# Altium project ESP32_KIT.PrjPcb
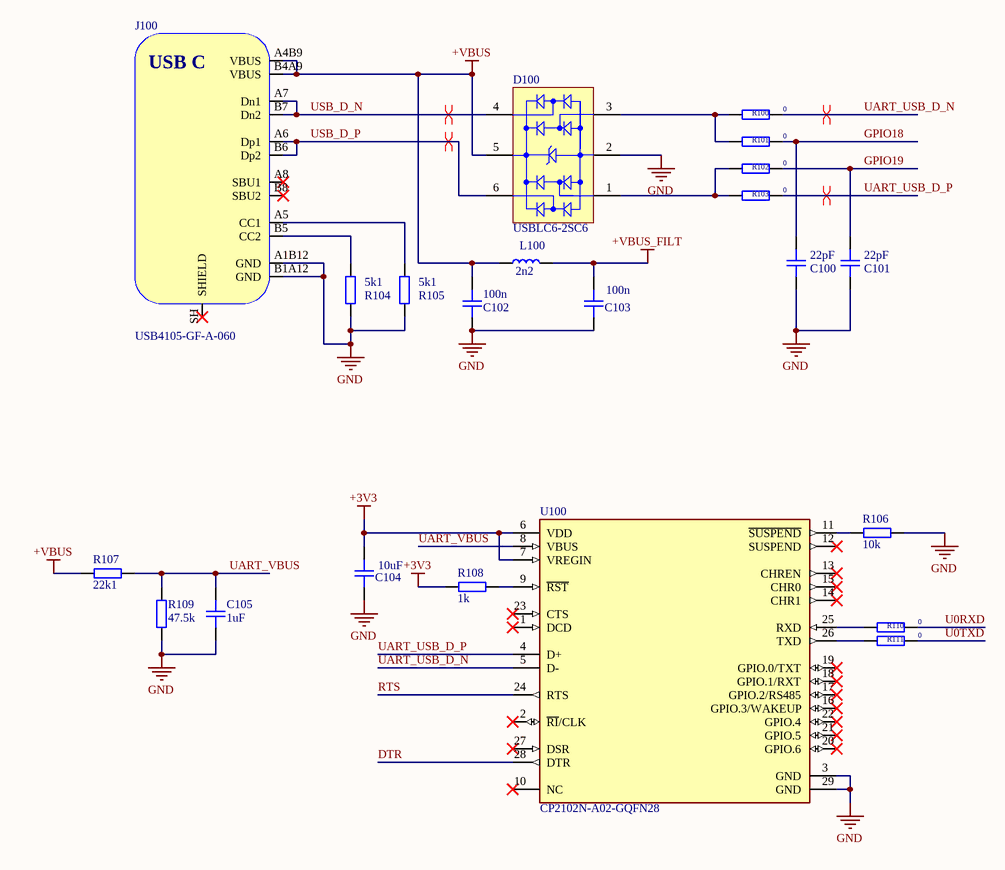
[diagram p0: 2_STM32KIT_UART.SchDoc]
4 sheets, 84 parts. Net scope: global (net labels, ports and power ports of the same name join across sheets).
Board file: ESP32_KIT.PcbDoc
Sheets:
  2_STM32KIT_UART.SchDoc
  3_STM32KIT_Power.SchDoc
  4_STM32KIT_MCU.SchDoc
  5_STM32KIT_Peripheral.SchDoc

## Sheet 2_STM32KIT_UART.SchDoc
size 381 x 241 mm; SheetNumber: 1; SheetTotal: 4

### Parts
C100  22pF  [CAP_0402]
C101  22pF  [CAP_0402]
C102  100n  [CAP_0603]
C103  100n  [CAP_0603]
C104  10uF  [CAP_0402]
C105  1uF  [CAP_0402]
D100  USBLC6-2SC6  [STM-SOT23-6L_V]
J100  USB4105-GF-A-060  [USB4105-GF-A-060]
L100  2n2  [IND_0603]
R100  0  [RES_0402]
R101  0  [RES_0402]
R102  0  [RES_0402]
R103  0  [RES_0402]
R104  5k1  [RES_0603]
R105  5k1  [RES_0603]
R106  10k  [RES_0402]
R107  22k1  [RES_0402]
R108  1k  [RES_0402]
R109  47.5k  [RES_0402]
R110  0  [RES_0402]
R111  0  [RES_0402]
U100  CP2102N-A02-GQFN28  [FP-CP2102N-A02-GQFN28-MFG]

### Nets
+3V3: C104.2 R108.1 U100.6(VDD) U100.7(VREGIN)
+VBUS: C102.2 D100.5(VBUS) J100.A4B9(VBUS) J100.B4A9(VBUS) L100.1 R107.2
+VBUS_FILT: C103.2 L100.2
GND: C100.1 C101.1 C102.1 C103.1 C104.1 C105.1 D100.2(GND) J100.A1B12(GND) J100.B1A12(GND) R104.1 R105.1 R106.2 R109.2 U100.3(GND) U100.29(GND)
DTR: U100.28(DTR)
GPIO18: C100.2 R101.2
GPIO19: C101.2 R102.2
RTS: U100.24(RTS)
U0RXD: R110.2
U0TXD: R111.2
UART_USB_D_N: R100.2 U100.5(D-)
UART_USB_D_P: R103.2 U100.4(D+)
UART_VBUS: C105.2 R107.1 R109.1 U100.8(VBUS)
USB_D_N: D100.4(I/O_3) J100.A7(Dn1) J100.B7(Dn2)
USB_D_P: D100.6(I/O_4) J100.A6(Dp1) J100.B6(Dp2)
NetD100_1: D100.1(I/O_1) R102.1 R103.1
NetD100_3: D100.3(I/O_2) R100.1 R101.1
NetJ100_A5: J100.A5(CC1) R105.2
NetJ100_B5: J100.B5(CC2) R104.2
NetR106_1: R106.1 U100.11(~{SUSPEND})
NetR108_2: R108.2 U100.9(~{RST})
NetR110_1: R110.1 U100.25(RXD)
NetR111_1: R111.1 U100.26(TXD)

Not connected (* = marked no-connect by the designer): J100 A8(SBU1)* B8(SBU2)* SH(SHIELD)*; U100 1(DCD)* 2(~{RI}/CLK)* 10(NC)* 12(SUSPEND)* 13(CHREN)* 14(CHR1)* 15(CHR0)* 16(GPIO.3/WAKEUP)* 17(GPIO.2/RS485)* 18(GPIO.1/RXT)* 19(GPIO.0/TXT)* 20(GPIO.6)* 21(GPIO.5)* 22(GPIO.4)* 23(CTS)* 27(DSR)*

### Layout directives
differential pair: UART_USB_D_N, UART_USB_D_P, USB_D_N, USB_D_P

### Notes on the sheet
- (in symbol CMP-002-00129-1) USB C

### Library data of the parts
C100 C101 C104 C105 = CMP-001-00086-1: Capacitor SMD 0402; Manufacturer: *; Distributor Link: *; Manufacturer Part Number: *; Design Item ID: CAP_0402; Dielectric: *; LCSC: *; Source: Schematic-Lib-PhilsLab.SchLib; Rating: *
C102 C103 = CMP-001-00087-1: Capacitor SMD 0603; Manufacturer Part Number: *; Distributor Link: *; Manufacturer: *; Rating: *; Design Item ID: CAP_0603; Source: Schematic-Lib-PhilsLab.SchLib; Dielectric: *; LCSC: *
D100 = CMP-2000-05378-1: Very low capacitance ESD protection, 3.5 pF, -40 to 125 degC, 6-Pin SOT23, RoHS, Tape and Reel; Manufacturer: STMicroelectronics; Polarity: Uni-Directional; Clamping Voltage: 17V; Rad Hardened: No; Product Height (mm): 1.3mm; Leakage Current (Max): 0.15uA; Product Length (mm): 3.05mm; Number of Elements: 1; Peak Pulse Current: 5A; Configuration: Dual; Reverse Breakdown Voltage: 6V; Working Voltage (Max): 5V; Capacitance Value: 3.5pF; Suppressor Type: DiodeArrays; Product Depth (mm): 1.75mm; Test Current (It): 1mA; Package / Case: SOT-23; Operating Temperature Max Deg. C: 125C; Package Description: 6-Pin Small Outline Transistor, Body 2.925 x 1.625 mm, Pitch 0.95 mm; Package Reference: SOT23-6L; Datasheet Version: Rev. 5, 10/2011; Operating Temperature Min Deg. C: -40C; Mounting Style: SurfaceMount; Direction Type: Uni-Directional; Mounting: SurfaceMount; Pin Count: 6; Leakage Current: 0.15uA; Packaging: TapeandReel; Operating Temperature Classification: Automotive; Clamping Voltage (Max): 17V; Manufacturer URL: http://www.st.com/; Reverse Stand-off Voltage: 5V; Datasheet URL: http://www.st.com/st-web-ui/static/active/en/resource/technical/document/datasheet/CD00050750.pdf; Working Voltage: 5V; Operating Temp Range: -40Cto125C; LCSC: C7519
J100 = CMP-002-00129-1: USB Connector Type C SMT 12 Pin; Manufacturer: GCT; Distributor Link: https://eu.mouser.com/ProductDetail/GCT/USB4105-GF-A-060?qs=QNEnbhJQKvY2mocwNJzgfA%3D%3D; Source: Schematic-Lib-PhilsLab.SchLib; Manufacturer Part Number: USB4105-GF-A-060; Design Item ID: USB4105-GF-A-060
L100 = CMP-006-00026-1: Inductor SMD 0603; Design Item ID: IND_0603; Source: Schematic-Lib-PhilsLab.SchLib
R100-R103 R106-R111 = CMP-009-00182-1: Resistor SMD 0402; Distributor Link: *; Source: Schematic-Lib-PhilsLab.SchLib; Manufacturer Part Number: *; LCSC: *; Design Item ID: RES_0402; Manufacturer: *
R104 R105 = CMP-009-00183-1: Resistor SMD 0603; Manufacturer Part Number: *; Distributor Link: *; LCSC: *; Source: Schematic-Lib-PhilsLab.SchLib; Manufacturer: *; Design Item ID: RES_0603
U100 = CMP-08093-000005-1: IC USB TO UART BRIDGE QFN28

## Sheet 3_STM32KIT_Power.SchDoc
size A; SheetNumber: 2; SheetTotal: 4; SPICEModelCacheICPTIIAS: <root> / <DocumentId>ICPTIIAS</DocumentId> / </root>
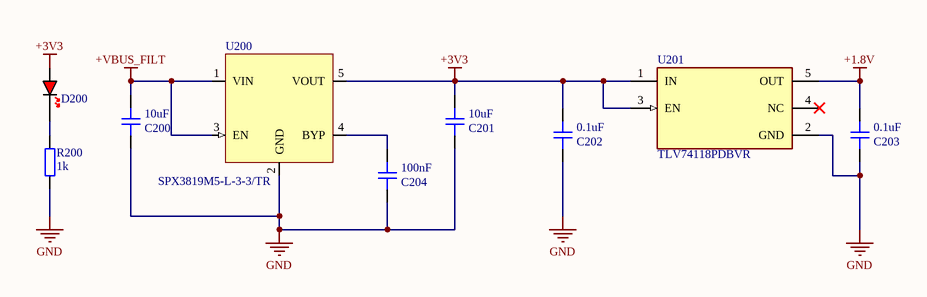
[diagram p1: 3_STM32KIT_Power.SchDoc]

### Parts
C200  10uF  [CAP_0402]
C201  10uF  [CAP_0402]
C202  0.1uF  [CAP_0402]
C203  0.1uF  [CAP_0402]
C204  100nF  [CAP_0402]
D200  RED  [LED_0402_RED]  (value not drawn)
R200  1k  [RES_0402]
U200  SPX3819M5-L-3-3/TR  [SOT-23-5]
U201  TLV74118PDBVR  [FP-DBV0005A-IPC_C]

### Nets
+1.8V: C203.2 U201.5(OUT)
+3V3: C201.2 C202.2 D200.A U200.5(VOUT) U201.1(IN) U201.3(EN)
+VBUS_FILT: C200.2 U200.1(VIN) U200.3(EN)
GND: C200.1 C201.1 C202.1 C203.1 C204.1 R200.1 U200.2(GND) U201.2(GND)
NetC204_2: C204.2 U200.4(BYP)
NetD200_K: D200.K R200.2

Not connected (* = marked no-connect by the designer): U201 4(NC)*

### Library data of the parts
C200-C204 = CMP-001-00086-1: Capacitor SMD 0402; Manufacturer: *; Distributor Link: *; Manufacturer Part Number: *; Design Item ID: CAP_0402; Dielectric: *; LCSC: *; Source: Schematic-Lib-PhilsLab.SchLib; Rating: *
D200 = LED_0402_RED: LED 0402 RED SMD
R200 = RES_0402: Resistor SMD 0402; Manufacturer: *; Manufacturer Part Number: *; Distributor Link: *; LCSC: *
U200 = CMP-028-000131-1: 500mA +3.3V Low-Noise LDO Voltage Regulator; Manufacturer: MaxLinear; Source: Schematic-Lib-PhilsLab.SchLib; Design Item ID: SPX3819M5-L-3-3/TR; Manufacturer Part Number: SPX3819M5-L-3-3/TR
U201 = CMP-04917-000111-2: None; Output Configuration: Positive; Number of Regulators: 1; Quiescent Current: 50uA; Max Input Voltage: 5.5V; Dropout Voltage: 695mV; Output Type: Fixed; Power Supply Rejection Ratio (PSRR): 55dB; Max Supply Current: 75uA; Output Current: 150mA; Min Output Voltage: 1.8V; Packaging: Cut Tape; Mount: Surface Mount; Max Operating Temperature: 125°C; Case/Package: SOT-23-5; RoHS Compliant: Yes; Min Operating Temperature: -40°C

## Sheet 4_STM32KIT_MCU.SchDoc
size 381 x 241 mm; SheetNumber: 3; SheetTotal: 4
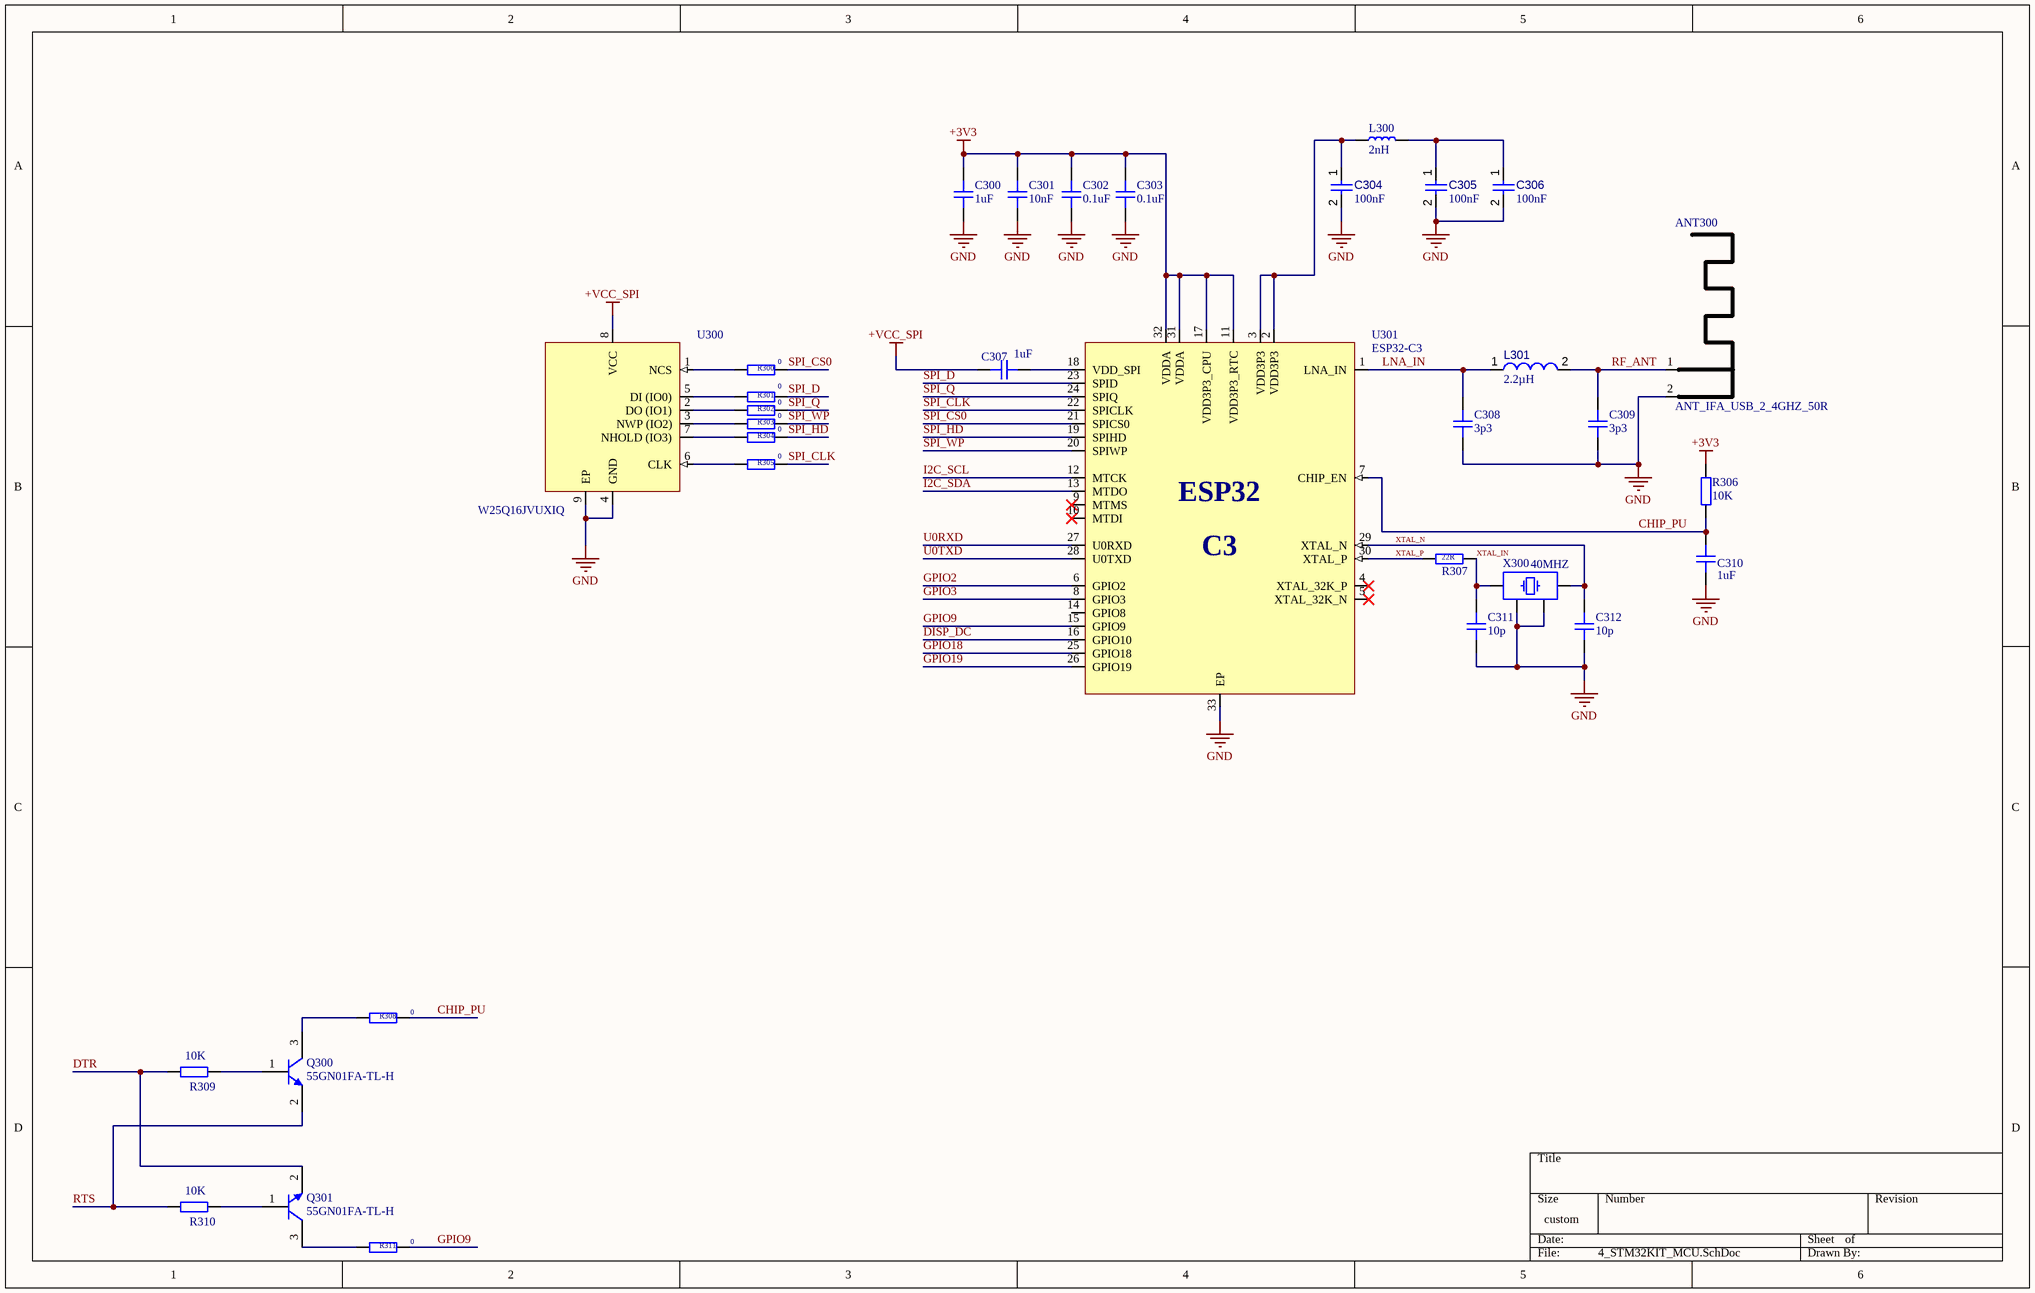
[diagram p2: 4_STM32KIT_MCU.SchDoc]

### Parts
ANT300  ANT_IFA_USB_2_4GHZ_50R  [ANT_IFA_USB_2_4GHZ_50R]  (no BOM)
C300  1uF  [CAP_0402]
C301  10nF  [CAP_0402]
C302  0.1uF  [CAP_0402]
C303  0.1uF  [CAP_0402]
C304  value 100nF  [CAPC1005X56X25LL10T15]  (hidden comment: Capacitor 0.1 uF +/- 5% 16 V 0402)
C305  value 100nF  [CAPC1005X56X25LL10T15]  (hidden comment: Capacitor 0.1 uF +/- 5% 16 V 0402)
C306  value 100nF  [CAPC1005X56X25LL10T15]  (hidden comment: 10u)
C307  1uF  [CAP_0402]
C308  3p3  [CAP_0402]
C309  3p3  [CAP_0402]
C310  1uF  [CAP_0402]
C311  10p  [CAP_0402]
C312  10p  [CAP_0402]
L300  2nH  [IND_0402]
L301  value 2.2µH  [IND1005X55X20VL5T10]  (hidden comment: ELJ-RF2N2DFB)
Q300  55GN01FA-TL-H  [ONSC-SSFP-3_V]
Q301  55GN01FA-TL-H  [ONSC-SSFP-3_V]
R300  0  [RES_0402]
R301  0  [RES_0402]
R302  0  [RES_0402]
R303  0  [RES_0402]
R304  0  [RES_0402]
R305  0  [RES_0402]
R306  10K  [RES_0402]
R307  22R  [RES_0402]
R308  0  [RES_0402]
R309  10K  [RES_0402]
R310  10K  [RES_0402]
R311  0  [RES_0402]
U300  W25Q16JVUXIQ  [USON-8-2X3MM]
U301  ESP32-C3  [QFN32-5X5]
X300  40MHZ  [XTAL_2520]

### Nets
+3V3: C300.2 C301.2 C302.2 C303.2 R306.2 U301.11(VDD3P3_RTC) U301.17(VDD3P3_CPU) U301.31(VDDA) U301.32(VDDA)
+VCC_SPI: C307.1 U300.8(VCC)
GND: ANT300.2(GND) C300.1 C301.1 C302.1 C303.1 C304.2 C305.2 C306.2 C308.1 C309.1 C310.1 C311.1 C312.1 U300.4(GND) U300.9(EP) U301.33(EP) X300.2 X300.4
CHIP_PU: C310.2 R306.1 R308.2 U301.7(CHIP_EN)
DISP_DC: U301.16(GPIO10)
DTR: Q301.2(E) R309.1
GPIO2: U301.6(GPIO2)
GPIO3: U301.8(GPIO3)
GPIO9: R311.2 U301.15(GPIO9)
GPIO18: U301.25(GPIO18)
GPIO19: U301.26(GPIO19)
I2C_SCL: U301.12(MTCK)
I2C_SDA: U301.13(MTDO)
LNA_IN: C308.2 L301.1 U301.1(LNA_IN)
RF_ANT: ANT300.1(RF) C309.2 L301.2
RTS: Q300.2(E) R310.1
SPI_CLK: R305.2 U301.22(SPICLK)
SPI_CS0: R300.2 U301.21(SPICS0)
SPI_D: R301.2 U301.23(SPID)
SPI_HD: R304.2 U301.19(SPIHD)
SPI_Q: R302.2 U301.24(SPIQ)
SPI_WP: R303.2 U301.20(SPIWP)
U0RXD: U301.27(U0RXD)
U0TXD: U301.28(U0TXD)
XTAL_IN: C311.2 R307.2 X300.1
XTAL_N: C312.2 U301.29(XTAL_N) X300.3
XTAL_P: R307.1 U301.30(XTAL_P)
NetC304_1: C304.1 L300.1 U301.2(VDD3P3) U301.3(VDD3P3)
NetC305_1: C305.1 C306.1 L300.2
NetC307_2: C307.2 U301.18(VDD_SPI)
NetQ300_1: Q300.1(B) R309.2
NetQ300_3: Q300.3(C) R308.1
NetQ301_1: Q301.1(B) R310.2
NetQ301_3: Q301.3(C) R311.1
NetR300_1: R300.1 U300.1(NCS)
NetR301_1: R301.1 U300.5(DI_(IO0))
NetR302_1: R302.1 U300.2(DO_(IO1))
NetR303_1: R303.1 U300.3(NWP_(IO2))
NetR304_1: R304.1 U300.7(NHOLD_(IO3))
NetR305_1: R305.1 U300.6(CLK)

Not connected (* = marked no-connect by the designer): U301 4(XTAL_32K_P)* 5(XTAL_32K_N)* 9(MTMS)* 10(MTDI)* 14(GPIO8)

### Notes on the sheet
- (in symbol CMP-028-000024-1) ESP32; C3

### Library data of the parts
ANT300 = CMP-028-000142-1: Inverted F 2.4GHz ISM PCB Antenna 50 Ohm; Design Item ID: ANT_IFA_USB_2_4GHZ_50R; ComponentLink1URL: https://www.ti.com/lit/an/swra117d/swra117d.pdf; ComponentLink1Description: Datasheet; Source: Schematic-Lib-PhilsLab.SchLib
C300-C303 = CAP_0402_50V: Capacitor SMD 0402 50V; Manufacturer: Samsung; Manufacturer Part Number: CL05B104KO5NNNC; LCSC: C1525
C304-C306 = CMP-001-00001-6: Chip Capacitor, 0.1 uF, +/- 5%, 16 V, 0402 (1005 Metric); Capacitor Type: Ceramic; Voltage Rating: 16V; Max Operating Temperature: 125°C; Min Operating Temperature: -55°C; Case/Package: 0402; Mounting Technology: SM; Pins: 2; Tolerance: 5%; RoHS Compliant: True
C307 C310 = CMP-001-00086-1: Capacitor SMD 0402; Manufacturer: *; Distributor Link: *; Manufacturer Part Number: *; Design Item ID: CAP_0402; Dielectric: *; LCSC: *; Source: Schematic-Lib-PhilsLab.SchLib; Rating: *
C308 C309 C311 C312 = CAP_0402: Capacitor SMD 0402; Manufacturer: *; Manufacturer Part Number: *; Distributor Link: *; LCSC: *; Rating: *; Dielectric: *
L300 = IND_0402: Inductor SMD 0402
L301 = CMP-006-00006-6: Chip Inductor, 2.2 nH, +/- 0.3 nH, 400 mA, -40 to 85 degC, 0402 (1005 Metric), RoHS, Tape and Reel; Manufacturer: Panasonic; Shielding: Unshielded; Current Rating: 400mA; Tolerance: 5%; Core Material: Ceramic; Q Factor: 8; Datasheet URL: http://www.bourns.com/docs/Product-Datasheets/cm322522.pdf; Case/Package: 0402; RoHS Compliant: True; Package Description: 2-Pin Surface Mount Device, Body 1 x 0.5 mm; Packaging: TapeandReel; Datasheet Version: Sep-12; Package Quantity: 10000; Package Reference: 0402; Min Operating Temperature: -20°C; Mounting Technology: SM; Max Operating Temperature: 85°C
Q300 Q301 = CMP-1030-00012-1: RF Transistor, 10 V, 70 mA, fT=5.5 GHz, NPN Single, 3-Pin SSFP, Pb-Free, Tape and Reel; Manufacturer: On Semiconductor; fT Min (MHz): 3000; IC Continuous (A): 0.07; hFE Max: 160; ComponentLink1Description: Manufacturer URL; ComponentLink2Description: Datasheet; Packing: Tape and Reel; ComponentLink1URL: http://www.onsemi.com/; Mounting Technology: Surface Mount; ComponentLink3Description: Package Specification; PackageDescription: 3-Pin Small Outline Transistor, Body 1.4 x 0.8 mm, Pitch 0.45 mm; PartNumber: 55GN01FA-TL-H; ComponentLink2URL: http://www.onsemi.com/pub_link/Collateral/55GN01FA.PDF; RoHS: TRUE; PackageReference: SSFP-3; Polarity: NPN; ComponentLink3URL: http://www.onsemi.com/pub_link/Collateral/55GN01FA.PDF
R300-R311 = CMP-009-00182-1: Resistor SMD 0402; Distributor Link: *; Source: Schematic-Lib-PhilsLab.SchLib; Manufacturer Part Number: *; LCSC: *; Design Item ID: RES_0402; Manufacturer: *
U300 = CMP-031-00020-1: 16M-BIT SERIAL FLASH MEMORY WITH DUAL/QUAD SPI USON-8; Manufacturer: Winbond; Design Item ID: W25Q16JVUXIQ; Source: Schematic-Lib-PhilsLab.SchLib; LCSC: C2843335; Manufacturer Part Number: W25Q16JVUXIQ
U301 = CMP-028-000024-1: Ultra­Low­Power SoC with RISC­V Single­Core CPU Supporting IEEE 802.11b/g/n (2.4 GHz Wi­Fi) and Bluetooth® 5 (LE); Manufacturer: Espressif; Source: Schematic-Lib-PhilsLab.SchLib; Manufacturer Part Number: ESP32-C3; Design Item ID: ESP32-C3; LCSC: C2838500
X300 = XTAL_2520: Crystal SMD 2520; Distributor Link: *

## Sheet 5_STM32KIT_Peripheral.SchDoc
size A; SheetNumber: 4; SheetTotal: 4
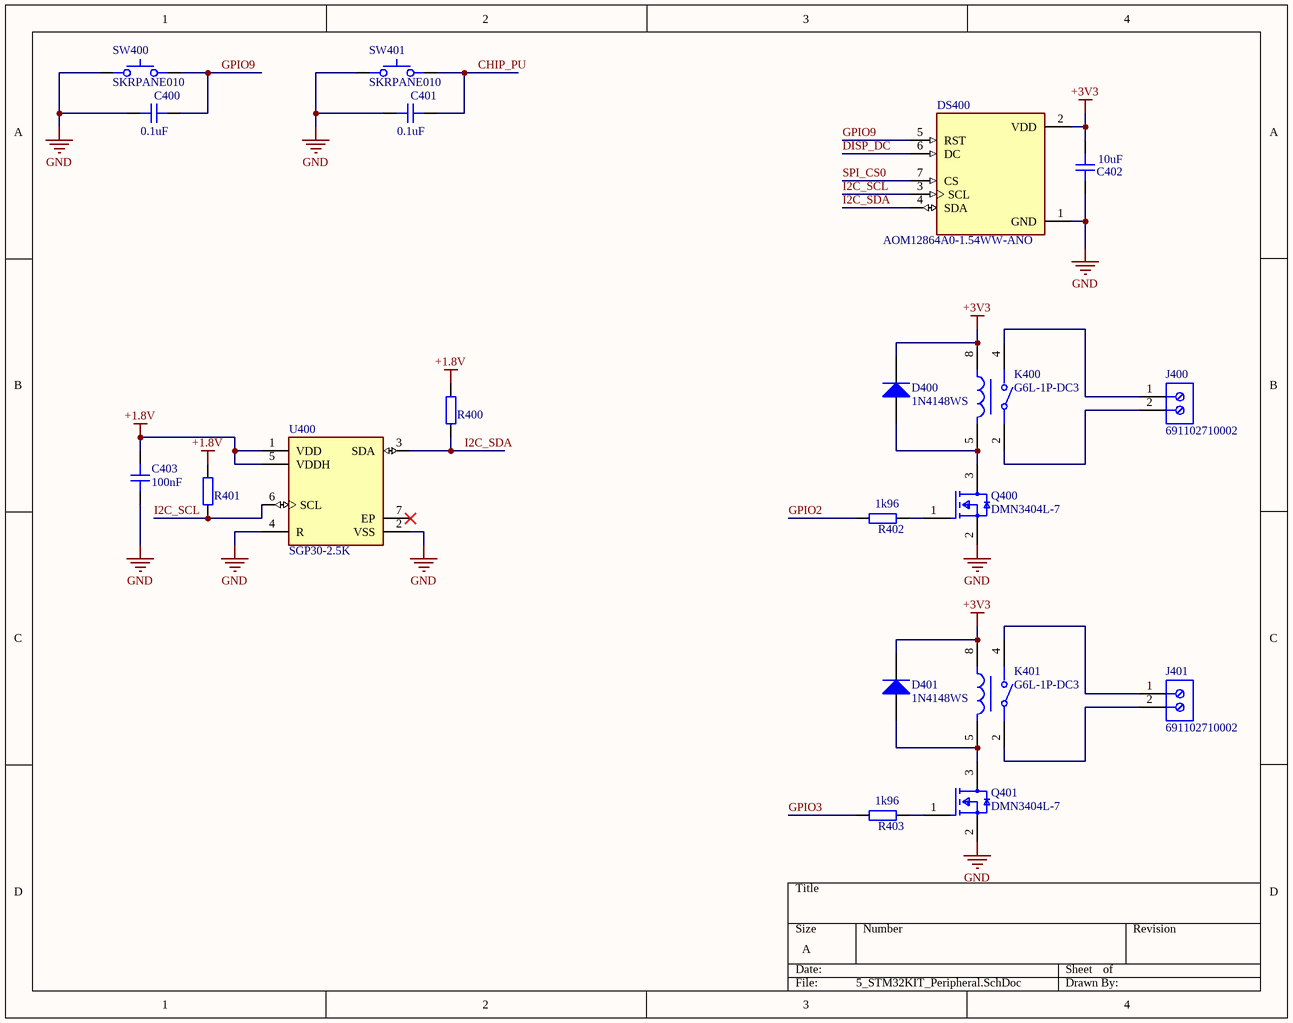
[diagram p3: 5_STM32KIT_Peripheral.SchDoc]

### Parts
C400  0.1uF  [CAP_0402]
C401  0.1uF  [CAP_0402]
C402  10uF  [CAP_0402]
C403  100nF  [CAP_0402]
D400  1N4148WS  [FAIR-SOD-323_V]
D401  1N4148WS  [FAIR-SOD-323_V]
DS400  AOM12864A0-1.54WW-ANO  [LCD_AOM12864A0-1.54WW-ANO]
J400  691102710002  [691102710002]
J401  691102710002  [691102710002]
K400  G6L-1P-DC3  [FP-G6L-1P-DC3-MFG]
K401  G6L-1P-DC3  [FP-G6L-1P-DC3-MFG]
Q400  DMN3404L-7  [FP-SOT23-MFG]
Q401  DMN3404L-7  [FP-SOT23-MFG]
R400  RES_0402  [RES_0402]  (value not drawn)
R401  RES_0402  [RES_0402]  (value not drawn)
R402  1k96  [RES_0402]
R403  1k96  [RES_0402]
SW400  SKRPANE010  [SKRPANE010]
SW401  SKRPANE010  [SKRPANE010]
U400  SGP30-2.5K  [FP-SGP30-2_5K-MFG]

### Nets
+1.8V: C403.2 R400.2 R401.2 U400.1(VDD) U400.5(VDDH)
+3V3: C402.2 D400.2(K) D401.2(K) DS400.2(VDD) K400.8 K401.8
GND: C400.1 C401.1 C402.1 C403.1 DS400.1(GND) Q400.2(S) Q401.2(S) SW400.34 SW401.34 U400.2(VSS) U400.4(R)
CHIP_PU: C401.2 SW401.12
DISP_DC: DS400.6(DC)
GPIO2: R402.1
GPIO3: R403.1
GPIO9: C400.2 DS400.5(RST) SW400.12
I2C_SCL: DS400.3(SCL) R401.1 U400.6(SCL)
I2C_SDA: DS400.4(SDA) R400.1 U400.3(SDA)
SPI_CS0: DS400.7(CS)
NetD400_1: D400.1(A) K400.5 Q400.3(D)
NetD401_1: D401.1(A) K401.5 Q401.3(D)
NetJ400_1: J400.1 K400.4
NetJ400_2: J400.2 K400.2
NetJ401_1: J401.1 K401.4
NetJ401_2: J401.2 K401.2
NetQ400_1: Q400.1(G) R402.2
NetQ401_1: Q401.1(G) R403.2

Not connected (* = marked no-connect by the designer): U400 7(EP)*

### Library data of the parts
C400-C403 = CMP-001-00086-1: Capacitor SMD 0402; Manufacturer: *; Distributor Link: *; Manufacturer Part Number: *; Design Item ID: CAP_0402; Dielectric: *; LCSC: *; Source: Schematic-Lib-PhilsLab.SchLib; Rating: *
D400 D401 = CMP-004-00001-2: Small Signal Diode, 75 V, 0.15 A, -55 to 150 degC, 2-Pin SOD-323, RoHS, Tape and Reel; Manufacturer: Fairchild; Recovery Time: 4ns; Forward Voltage: 1V; Peak Reverse Current: 5uA; Forward Current: 150mA; Capacitance: -323f; Datasheet URL: https://www.fairchildsemi.com/datasheets/1N/1N4148WS.pdf; Package Reference: SOD-323; Package Description: 2-Pin Small Outline Diode Flat Lead, Body 1.7 x 1.25 mm; Case/Package: SOD-323; Mounting Technology: SM; Manufacturer URL: https://www.fairchildsemi.com/; Pins: 2; Packaging: TapeandReel; Package Quantity: 3000; Min Operating Temperature: -55°C; RoHS Compliant: True; Max Operating Temperature: 150°C; Datasheet Version: Rev. 1.2, 03/2015
DS400 = CMP-007-00037-1: Non-Touch Graphic LCD Display Module - White OLED SPI 1.54 (39.12mm) 128 x 64; MF: Orient Display; Availability: In Stock; Pins: 7; MP: AOM12864A0-1.54WW-ANO; Check_prices: https://www.snapeda.com/parts/AOM12864A0-1.54WW-ANO/Orient+Display/view-part/?ref=eda; Case/Package: None; Value: *; Purchase-URL: https://pricing.snapeda.com/search/part/AOM12864A0-1.54WW-ANO/?ref=eda; Component Type: Standard; Source: AOM12864A0-1.54WW-ANO.SchLib; Design Item ID: AOM12864A0-1.54WW-ANO; SnapEDA_Link: https://www.snapeda.com/parts/AOM12864A0-1.54WW-ANO/Orient+Display/view-part/?ref=snap; Price: None
J400 J401 = CMP-1502-03258-2: NexarPartId: 8917706; Number of Levels: 1; Number of Positions Per Level: 2; Current: 15A; Voltage: 300V; Pitch: 5.0038mm; Plating: Steel; Stripping Length: -6mm; Wire Gauge (Min): 14AWG; Wire Gauge (Max): 22AWG; Length: 7.5mm; Contact Material: Brass; Contact Plating: Tin; Packaging: Box; Number of Pins: 2; Voltage Rating: 300V; Termination: Screw; Number of Contacts: 2; Color: Blue; Current Rating: 15A; Mount: Through Hole; Max Operating Temperature: 105°C; Min Operating Temperature: -40°C; REACH SVHC: Unknown; Height: 13.4mm; Width: 11.2mm; Housing Material: Nylon; RoHS: Compliant; Wire/Cable Gauge: 22AWG; Lead Pitch: 5mm
K400 K401 = CMP-08823-000074-1: RELAY TELECOM SPST 1A 3VDC; Release Time: 5ms; Coil Resistance: 50R; Approvals: UL; Power Rating: 180mW; Coil Voltage (DC): 3V; Voltage Rating (AC): 125V; Life (Hours): 100000Hour; Coil Current: 60mA; Max Voltage Rating (DC): 60V; Coil Type: Non-Latching; Application(s): SIGNAL; Relay Type: Telecom; Length: 10.6mm; Series: G6L; Max Operating Temperature: 70°C; Mount: Through Hole; Operate Time: 5ms; Throw Configuration: SPST; RoHS Compliant: Yes; Packaging: Rail/Tube; Current Rating: 1A; Depth: 7mm; Height: 4.1mm; Min Operating Temperature: -40°C; Power Consumption: 180mW; Contact Material: Silver; Contact Current Rating: 1A; Max Current Rating: 1A; Weight: 0.021164oz; Lead Free: Lead Free; Package Quantity: 1000; Max Voltage Rating (AC): 125V; Coil Power: 180mW; Number of Pins: 4; Termination: PC Pin
Q400 Q401 = CMP-12801-000054-1: MOSFET N-CH 30V 5.8A SOT-23; Manufacturer: Diodes Inc.; Gate Charge At Vgs: 11.3nC @ 10V; Number Of Channels: 1; Depletion Mode: False; Threshold Vgs Min: 1V; Max Junction Temp: +150°C; Automotive Grade: NA; Power Dissipation: 0.72W; Turn On Delay Time: 3.41ns; Drain To Source Resistance: 24mΩ; Continuous Drain Current: 4.2A; Gate To Source Voltage: 20V; Input Capacitace At Vds: 498pF @ 15V; Rthja Max: 173°C/W; Typ Forward Diode Voltage: 0.75V; Standoff Height: 0.013mm; Turn Off Delay Time: 13.92ns; Threshold Vgs Max: 2V; Pulse Drain Current: 30A; Category: Trans; Manufacturer Part Number: DMN3404L-7; Device Class L2: Transistors; Device Class L1: Discrete Semiconductors; RoHS: TRUE; Height: 1.1mm; Footprint Url: https://www.diodes.com/assets/Package-Files/SOT23.pdf; Temperature Range Low: -55°C; ComponentLink2Description: Datasheet; Package: SOT23; Mouser Description: N-Channel 30 V 28 mOhm Surface Mount Enhancement Mode Mosfet - SOT-23-3; Drain To Source Voltage: 30V; Device Class L3: MOSFETs; Temperature Range High: +150°C; Temperature: -55°C to +150°C; Drain To Source Breakdown Voltage: 30V; Digikey Description: MOSFET N-CH 30V 5.8A SOT-23; Automotive: No; ComponentLink2URL: https://www.diodes.com/assets/Datasheets/ds31787.pdf; Octopart: https://octopart.com/dmn3404l-7-diodes+inc.-12409285; Number Of N Channels: 1; Max Forward Diode Voltage: 1V; Lead Free: Yes
R400-R403 = CMP-009-00182-1: Resistor SMD 0402; Distributor Link: *; Source: Schematic-Lib-PhilsLab.SchLib; Manufacturer Part Number: *; LCSC: *; Design Item ID: RES_0402; Manufacturer: *
SW400 SW401 = SKRPANE010: Tactile Switch SMD SPST; Manufacturer: Alps Alpine; Manufacturer Part Number: SKRPANE010; LCSC: C470426
U400 = CMP-144026-000002-1: AIR QUALITY GAS SENSOR FOR VOC'S; Manufacturer: Sensirion; Min Supply Voltage: 1.62V; Sensor Output: I2C; Operating Supply Current: 48.8mA; Max Supply Voltage: 1.98V; Category: IC; Automotive: No; Device Class L3: unset; Device Class L1: Sensors; Device Class L2: unset; Temperature Range High: +85°C; Manufacturer Part Number: SGP30-2.5K; Octopart: https://octopart.com/sgp30-2.5k-sensirion-84561789; Height: 0.9mm; Temperature: -40°C to +85°C; Lead Free: Yes; Package: SGP30-2.5K; Temperature Range Low: -40°C; Digikey Description: AIR QUALITY GAS SENSOR FOR VOC'S; RoHS: TRUE; ComponentLink2Description: Datasheet; ComponentLink2URL: https://www.sensirion.com/fileadmin/user_upload/customers/sensirion/Dokumente/0_Datasheets/Gas/Sensirion_Gas_Sensors_SGP30_Datasheet.pdf

## Nets that join several sheets
+1.8V: 3_STM32KIT_Power (C203.2 U201.5), 5_STM32KIT_Peripheral (5 pins)
+3V3: 2_STM32KIT_UART (C104.2 R108.1 U100.6 U100.7), 3_STM32KIT_Power (6 pins), 4_STM32KIT_MCU (9 pins), 5_STM32KIT_Peripheral (6 pins)
+VBUS_FILT: 2_STM32KIT_UART (C103.2 L100.2), 3_STM32KIT_Power (C200.2 U200.1 U200.3)
GND: 2_STM32KIT_UART (15 pins), 3_STM32KIT_Power (8 pins), 4_STM32KIT_MCU (18 pins), 5_STM32KIT_Peripheral (11 pins)
CHIP_PU: 4_STM32KIT_MCU (C310.2 R306.1 R308.2 U301.7), 5_STM32KIT_Peripheral (C401.2 SW401.12)
DISP_DC: 4_STM32KIT_MCU (U301.16), 5_STM32KIT_Peripheral (DS400.6)
DTR: 2_STM32KIT_UART (U100.28), 4_STM32KIT_MCU (Q301.2 R309.1)
GPIO2: 4_STM32KIT_MCU (U301.6), 5_STM32KIT_Peripheral (R402.1)
GPIO3: 4_STM32KIT_MCU (U301.8), 5_STM32KIT_Peripheral (R403.1)
GPIO9: 4_STM32KIT_MCU (R311.2 U301.15), 5_STM32KIT_Peripheral (C400.2 DS400.5 SW400.12)
GPIO18: 2_STM32KIT_UART (C100.2 R101.2), 4_STM32KIT_MCU (U301.25)
GPIO19: 2_STM32KIT_UART (C101.2 R102.2), 4_STM32KIT_MCU (U301.26)
I2C_SCL: 4_STM32KIT_MCU (U301.12), 5_STM32KIT_Peripheral (DS400.3 R401.1 U400.6)
I2C_SDA: 4_STM32KIT_MCU (U301.13), 5_STM32KIT_Peripheral (DS400.4 R400.1 U400.3)
RTS: 2_STM32KIT_UART (U100.24), 4_STM32KIT_MCU (Q300.2 R310.1)
SPI_CS0: 4_STM32KIT_MCU (R300.2 U301.21), 5_STM32KIT_Peripheral (DS400.7)
U0RXD: 2_STM32KIT_UART (R110.2), 4_STM32KIT_MCU (U301.27)
U0TXD: 2_STM32KIT_UART (R111.2), 4_STM32KIT_MCU (U301.28)